# EAGLE design ManualShield (EAGLE 8.6.0)
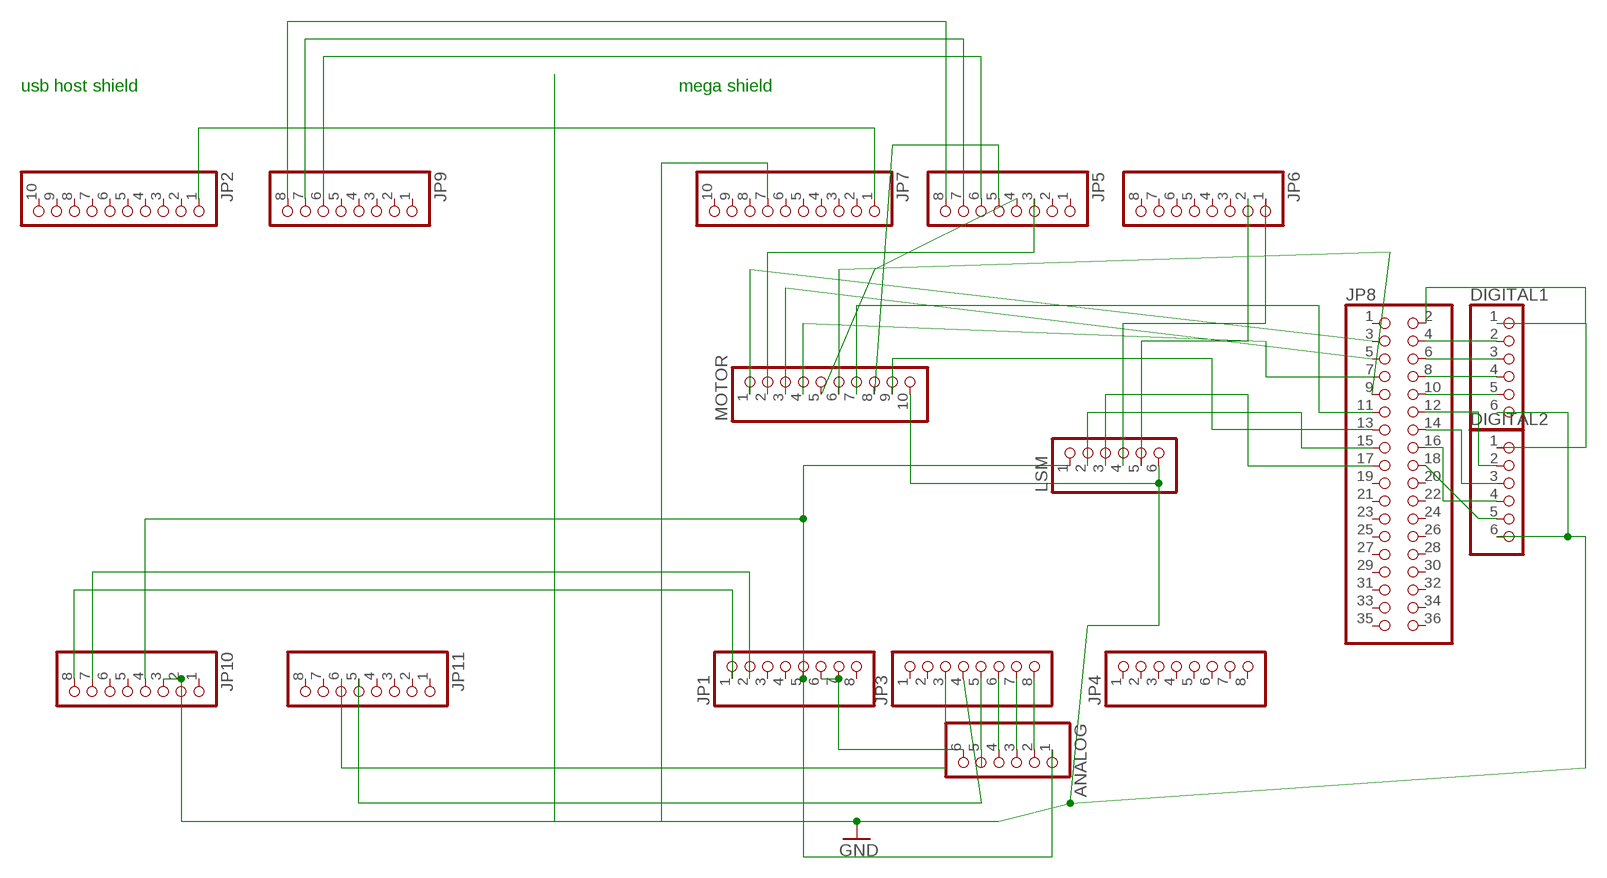
[diagram p0: schematic, sheet 1]

## Parts
ANALOG  PINHD-1X6  [1X06]
DIGITAL1  PINHD-1X6  [1X06]
DIGITAL2  PINHD-1X6  [1X06]
JP1  PINHD-1X8  [1X08]
JP2  PINHD-1X10  [1X10]
JP3  PINHD-1X8  [1X08]
JP4  PINHD-1X8  [1X08]
JP5  PINHD-1X8  [1X08]
JP6  PINHD-1X8  [1X08]
JP7  PINHD-1X10  [1X10]
JP8  PINHD-2X18  [2X18]
JP9  PINHD-1X8  [1X08]
JP10  PINHD-1X8  [1X08]
JP11  PINHD-1X8  [1X08]
LSM  PINHD-1X6  [1X06]
MOTOR  PINHD-1X10  [1X10]

## Nets
GND: DIGITAL1.6 DIGITAL2.6 JP7.7 JP10.2 JP10.3 LSM.6 MOTOR.10
N$1: JP6.2 LSM.5
N$2: JP6.1 LSM.4
N$3: ANALOG.1 JP1.5 JP10.4 LSM.1
N$4: JP5.3 MOTOR.2
N$5: JP5.4 MOTOR.5
N$6: JP5.5 MOTOR.8
N$7: DIGITAL1.2 JP8.4
N$8: JP8.3 MOTOR.1
N$9: JP8.5 MOTOR.3
N$10: JP8.7 MOTOR.4
N$11: JP8.9 MOTOR.6
N$12: JP8.11 MOTOR.7
N$13: JP8.13 MOTOR.9
N$14: JP8.15 LSM.2
N$15: JP8.17 LSM.3
N$16: ANALOG.2 JP3.8
N$17: ANALOG.3 JP3.7
N$18: ANALOG.4 JP3.6
N$19: ANALOG.5 JP3.5
N$21: JP5.6 JP9.6
N$22: JP5.7 JP9.7
N$23: JP2.1 JP7.1
N$24: DIGITAL1.3 JP8.6
N$25: DIGITAL1.4 JP8.8
N$26: DIGITAL1.5 JP8.10
N$27: DIGITAL2.2 JP8.12
N$28: DIGITAL2.3 JP8.14
N$29: DIGITAL1.1 DIGITAL2.1 JP8.2
N$30: DIGITAL2.4 JP8.16
N$31: DIGITAL2.5 JP8.18
N$32: JP5.8 JP9.8
N$33: JP3.3 JP11.6
N$34: JP3.4 JP11.5
N$35: JP1.1 JP10.8
N$36: JP1.2 JP10.7
N$37: ANALOG.6 JP1.6 JP1.7
Unconnected: JP1.3 JP1.4 JP1.8 JP2.2 JP2.3 JP2.4 JP2.5 JP2.6 JP2.7 JP2.8 JP2.9 JP2.10 JP3.1 JP3.2 JP4.1 JP4.2 JP4.3 JP4.4 JP4.5 JP4.6 JP4.7 JP4.8 JP5.1 JP5.2 JP6.3 JP6.4 JP6.5 JP6.6 JP6.7 JP6.8 JP7.2 JP7.3 JP7.4 JP7.5 JP7.6 JP7.8 JP7.9 JP7.10 JP8.1 JP8.19 JP8.20 JP8.21 JP8.22 JP8.23 JP8.24 JP8.25 JP8.26 JP8.27 JP8.28 JP8.29 JP8.30 JP8.31 JP8.32 JP8.33 JP8.34 JP8.35 JP8.36 JP9.1 JP9.2 JP9.3 JP9.4 JP9.5 JP10.1 JP10.5 JP10.6 JP11.1 JP11.2 JP11.3 JP11.4 JP11.7 JP11.8

## Notes on the sheet
- usb host shield | mega shield

## Library data of the parts
ANALOG DIGITAL1 DIGITAL2 LSM = pinhead:PINHD-1X6: PIN HEADER
JP1 JP3-JP6 JP9-JP11 = pinhead:PINHD-1X8: PIN HEADER
JP2 JP7 MOTOR = pinhead:PINHD-1X10: PIN HEADER
JP8 = pinhead:PINHD-2X18: PIN HEADER

## Board
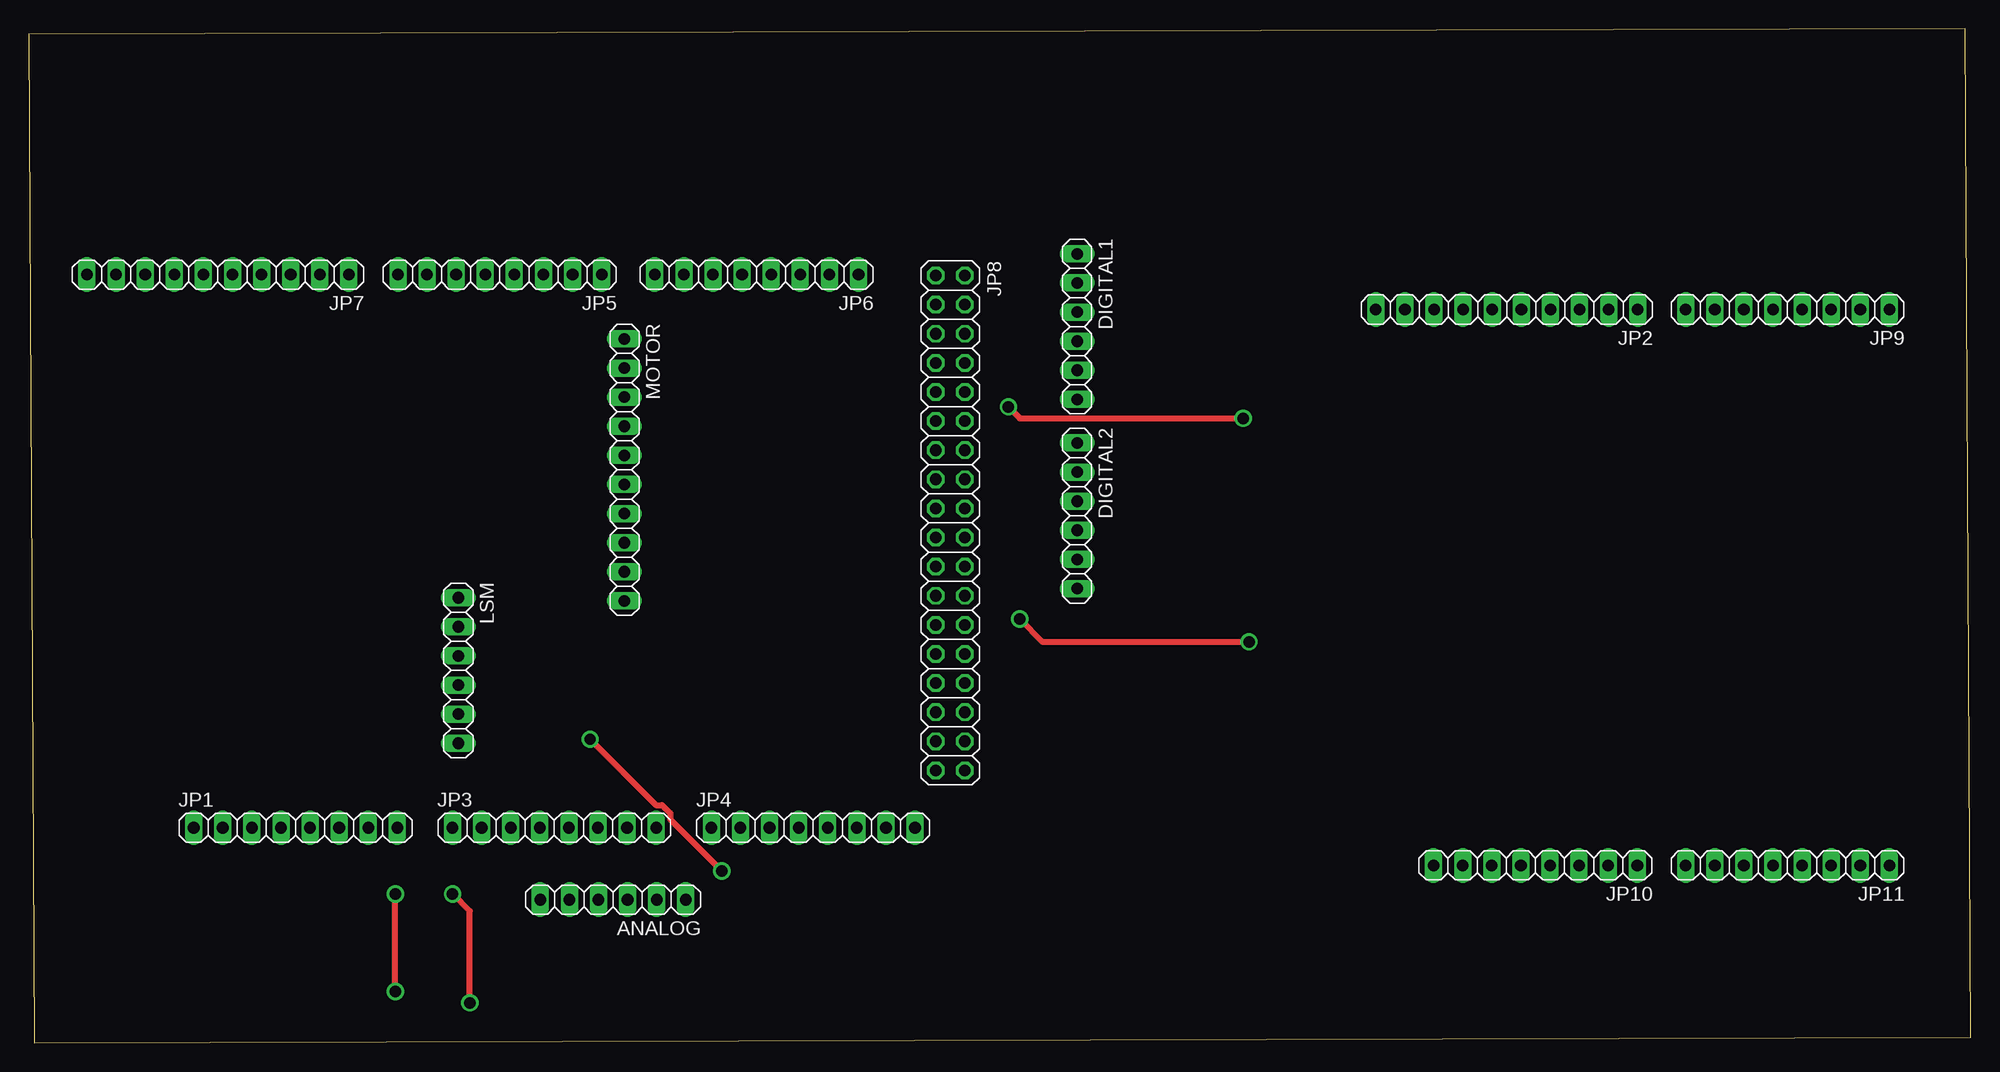
[diagram p1: board, top side]
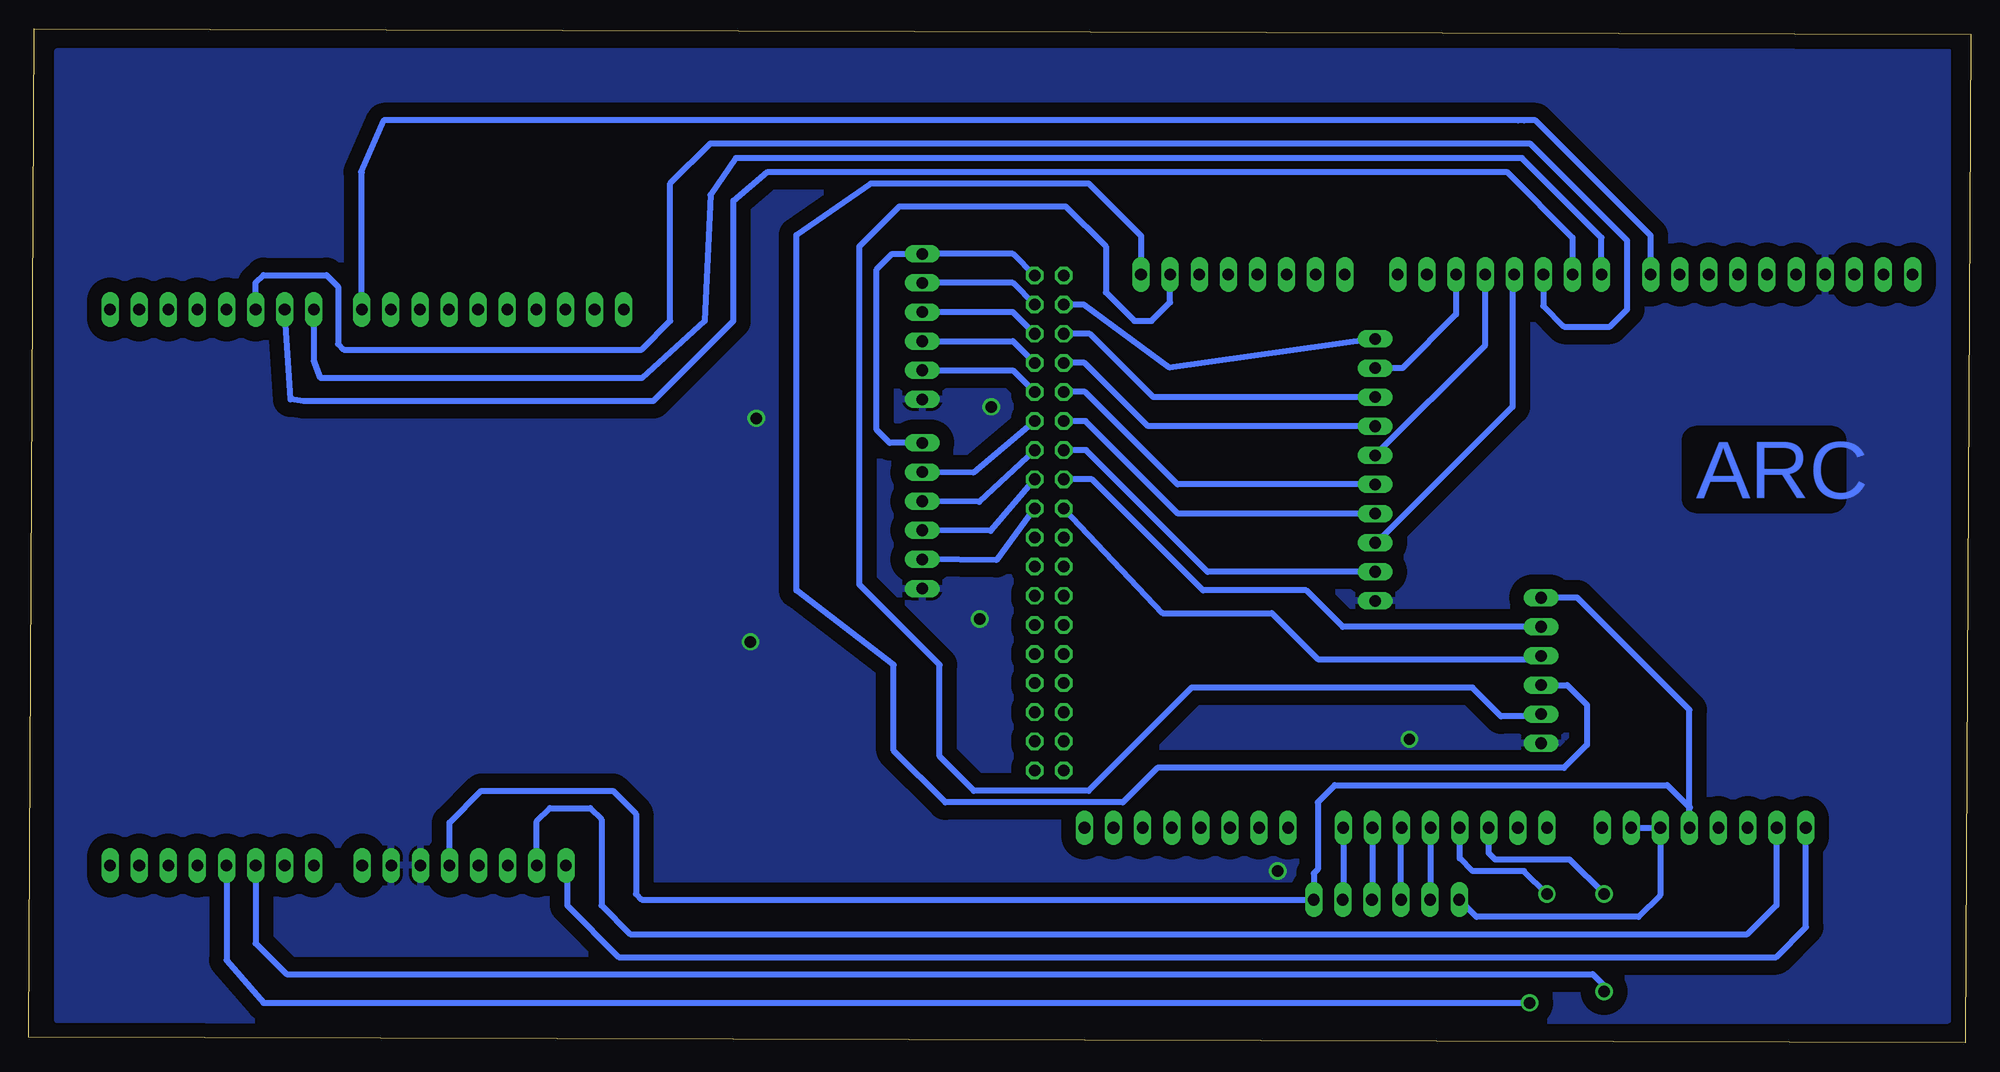
[diagram p2: board, bottom side, seen from below]

Size 169.5 x 88.5 mm. Coordinates in mm from the lower left corner, seen from the top.
Outline: 0.5,0 169.5,0.5 169,88.5 0,88 0.5,0
Copper layers (1*16): Top 0.035mm / dielectric 1.5mm / Bottom 0.035mm
Design rules "default": minimum track width 10mil, minimum drill 24mil, track to track 8mil, track to pad 8mil, pad to pad 8mil, via to via 8mil, smd to smd 8mil, copper to edge 40mil, drill to drill 8mil, minimum pad ring 10mil, minimum via ring 8mil, stop-mask expansion 4mil, vias tented up to drill 0mil, thermal gap 10mil

### Footprints (pad centres in the part's own frame; a part is rotated, then mirrored left to right if it is on the bottom)
1X06 = drill 1.016 long: 1 -6.35,0; 2 -3.81,0; 3 -1.27,0; 4 1.27,0; 5 3.81,0; 6 6.35,0
1X08 = drill 1.016 long: 1 -8.89,0; 2 -6.35,0; 3 -3.81,0; 4 -1.27,0; 5 1.27,0; 6 3.81,0; 7 6.35,0; 8 8.89,0
1X10 = drill 1.016 long: 1 -11.43,0; 2 -8.89,0; 3 -6.35,0; 4 -3.81,0; 5 -1.27,0; 6 1.27,0; 7 3.81,0; 8 6.35,0; 9 8.89,0; 10 11.43,0
2X18 = drill 1.016 octagon: 1 -21.59,-1.27; 2 -21.59,1.27; 3 -19.05,-1.27; 4 -19.05,1.27; 5 -16.51,-1.27; 6 -16.51,1.27; 7 -13.97,-1.27; 8 -13.97,1.27; 9 -11.43,-1.27; 10 -11.43,1.27; 11 -8.89,-1.27; 12 -8.89,1.27; 13 -6.35,-1.27; 14 -6.35,1.27; 15 -3.81,-1.27; 16 -3.81,1.27; 17 -1.27,-1.27; 18 -1.27,1.27; 19 1.27,-1.27; 20 1.27,1.27; 21 3.81,-1.27; 22 3.81,1.27; 23 6.35,-1.27; 24 6.35,1.27; 25 8.89,-1.27; 26 8.89,1.27; 27 11.43,-1.27; 28 11.43,1.27; 29 13.97,-1.27; 30 13.97,1.27; 31 16.51,-1.27; 32 16.51,1.27; 33 19.05,-1.27; 34 19.05,1.27; 35 21.59,-1.27; 36 21.59,1.27

### Placement (x,y rotation side)
ANALOG  51,12.5 180 top
DIGITAL1  91.5,62.5 270 top
DIGITAL2  91.5,46 270 top
JP1  23.29,18.78 0 top
JP2  129,64 180 top
JP3  45.88,18.78 0 top
JP4  68.47,18.78 0 top
JP5  41.12,67.04 180 top
JP6  63.53,67.04 180 top
JP7  16.52,67.04 180 top
JP8  80.44,45.37 270 top
JP9  153.5,64 180 top
JP10  131.5,15.5 180 top
JP11  153.5,15.5 180 top
LSM  37.5,32.5 270 top
MOTOR  52,50 270 top

### Tracks (layer width: path | path; a pad name or v marks a point on that pad's centre or on a via)
GND  (via drill 1 pad 1.2)
  Top 0.508: v49,26.5 54.74,20.76 55.27,20.76 55.99,20.05 55.99,19.51 60,15.5 60,15 v60.5,15 | v85.5,55.5 86.5,54.5 v106,54.5 | v86.5,37 88.5,35 v106.5,35
  pour Bottom (isolate 1.27): 2,86.5 167,86.5 167,2 2,2
N$1
  Bottom 0.508: JP6.2 69.88,64.62 71.5,63 73,63 75.5,65.5 75.5,69.5 79,73 93.5,73 97,69.5 97,40 90,33 90,25 87,22 77,22 68,31 43.5,31 41,28.5 37.69,28.5 LSM.5
N$2
  Bottom 0.508: LSM.4 35.23,31.23 33.5,29.5 33.5,26 35.5,24 71,24 74,21 89.5,21 94,25.5 94,33 102.5,39.5 102.5,70.5 96,75 77,75 72.42,70.42 JP6.1
N$3
  Bottom 0.508: 24.56,20.5 JP1.5 24.56,29.06 34.35,38.85 LSM.1 | 24.56,20.5 24.56,20.56 26.5,22.5 55.5,22.5 57,21 57,15.15 57.35,14.8 ANALOG.1 116,12.5 116.5,13 116.5,20 118.5,22 130,22 132.77,19.23 JP10.4 | 24.5,20.56 24.56,20.5
N$4
  Bottom 0.508: JP5.3 44.93,63.57 49.61,58.89 MOTOR.2
N$5
  Bottom 0.508: MOTOR.5 42.39,60.88 JP5.4
N$6
  Bottom 0.508: JP5.5 40,67 40,55.5 52,43.5 MOTOR.8
N$7
  Bottom 0.508: JP8.4 83.6,66.31 DIGITAL1.2
N$8
  Bottom 0.508: MOTOR.1 69.93,58.93 77.42,64.42 JP8.3
N$9
  Bottom 0.508: MOTOR.3 71.35,56.35 76.88,61.88 JP8.5
N$10
  Bottom 0.508: MOTOR.4 71.81,53.81 77.34,59.34 JP8.7
N$11
  Bottom 0.508: MOTOR.6 69.23,48.73 77.3,56.8 JP8.9
N$12
  Bottom 0.508: MOTOR.7 69.19,46.19 77.26,54.26 JP8.11
N$13
  Bottom 0.508: MOTOR.9 66.61,41.11 77.22,51.72 JP8.13
N$14
  Bottom 0.508: LSM.2 54.81,36.31 58,39.5 67,39.5 76.68,49.18 JP8.15
N$15
  Bottom 0.508: JP8.17 70.53,37.5 61,37.5 57,33.5 38.27,33.5 LSM.3
N$16
  Bottom 0.508: JP3.8 54.77,12.54 ANALOG.2
N$17
  Bottom 0.508: JP3.7 52.23,12.54 ANALOG.3
N$18
  Bottom 0.508: ANALOG.4 49.73,18.74 JP3.6
N$19
  Bottom 0.508: JP3.5 47.15,12.54 ANALOG.5
N$21
  Bottom 0.508: JP5.6 37.31,64.31 35.5,62.5 31.5,62.5 30,64 30,70 38.5,78.5 110,78.5 113.5,75 113.5,63 116,60.5 142,60.5 142.5,61 142.5,66 143.5,67 149,67 149.69,66.31 JP9.6
N$22
  Bottom 0.508: 34.77,66.27 JP5.7 34.77,70.27 40.5,76 105,76 108,73.5 108,63 115,56 145.5,56 146.65,56.15 JP9.7
N$23
  Bottom 0.508: JP2.1 140.43,75.93 140.5,76 138.5,80.5 39.5,80.5 39,80.5 38,80.5 27.95,70.45 JP7.1
N$24
  Bottom 0.508: JP8.6 83.6,63.77 DIGITAL1.3
N$25
  Bottom 0.508: DIGITAL1.4 83.6,61.23 JP8.8
N$26
  Bottom 0.508: DIGITAL1.5 83.6,58.69 JP8.10
N$27
  Bottom 0.508: JP8.12 87.05,49.76 DIGITAL2.2
N$28
  Bottom 0.508: JP8.14 86.55,47.22 DIGITAL2.3
N$29
  Bottom 0.508: JP8.2 83.6,68.85 DIGITAL1.1 94.15,68.85 95.5,67.5 95.5,53.5 94.35,52.35 DIGITAL2.1
N$30
  Bottom 0.508: JP8.16 85.55,44.68 DIGITAL2.4
N$31
  Bottom 0.508: JP8.18 85.05,42.14 DIGITAL2.5
N$32
  Bottom 0.508: JP9.8 144.61,59.61 144,58 116,58 110.5,63 110,74 107.79,77.21 39.17,77.21 32.23,70.27 JP5.8
N$33  (via drill 1 pad 1.2)
  Top 0.508: v32,4.5 v32,13
  Bottom 0.508: JP11.6 149.69,8.69 147,6 33,6 32,5 v32,4.5 | v32,13 35,16 41.5,16 42.07,16.57 JP3.3
N$34  (via drill 1 pad 1.2)
  Top 0.508: v38.5,3.5 38.5,11.5 v37,13
  Bottom 0.508: v37,13 39,15 43.5,15 44.61,16.11 JP3.4 | v38.5,3.5 149,3.5 152.23,7.23 JP11.5
N$35
  Bottom 0.508: JP1.1 14.4,10.1 17,7.5 118,7.5 122.5,12 122.5,15.39 JP10.8
N$36
  Bottom 0.508: JP10.7 125.15,19.35 124,20.5 120.5,20.5 119.5,19.5 119.5,12 117,9.5 19.5,9.5 17,12 16.94,12 JP1.2
N$37
  Bottom 0.508: JP1.7 JP1.6 27.1,12.9 29,11 43.15,11 ANALOG.6

### Text on the board
Bottom: ARC